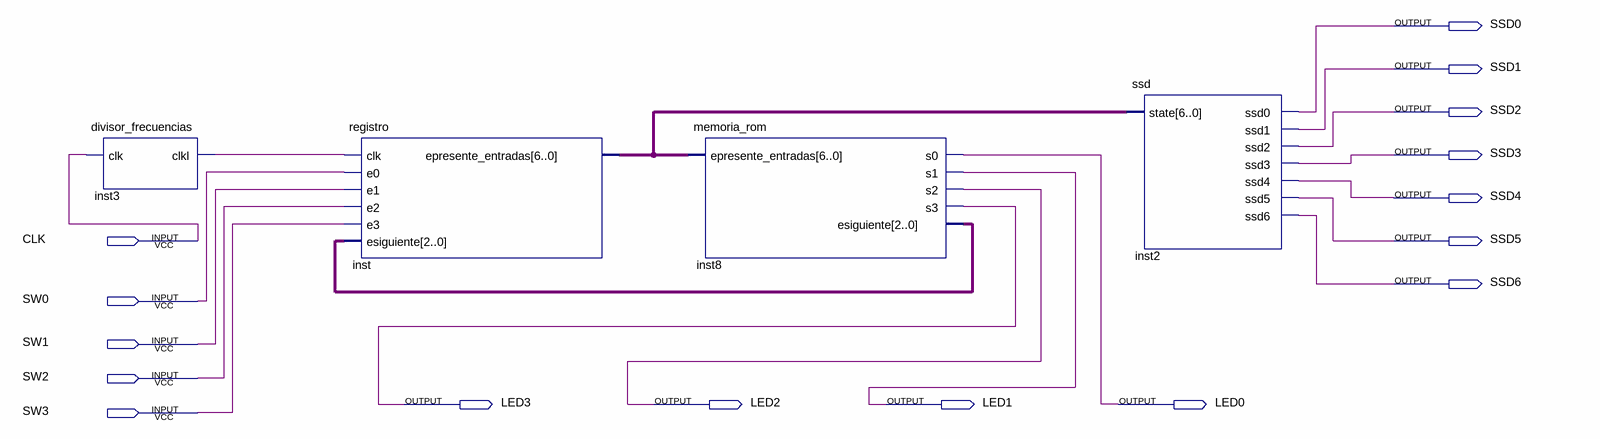
[diagram p0: schematic sheet]
// Quartus schematic Practica2.bdf as structural Verilog: 4 symbols, 16 pins
module Practica2 (
  input  CLK,
  input  SW0,
  input  SW1,
  input  SW2,
  input  SW3,
  output SSD0,
  output SSD1,
  output SSD2,
  output SSD3,
  output SSD4,
  output SSD5,
  output SSD6,
  output LED3,
  output LED2,
  output LED1,
  output LED0
);

  wire inst3_clkl;
  wire [2:0] inst8_esiguiente;
  wire [6:0] inst_epresente_entradas;

  divisor_frecuencias inst3 (.clk(CLK), .clkl(inst3_clkl));
  registro inst (
    .clk(inst3_clkl), .e0(SW0), .e1(SW1), .e2(SW2), .e3(SW3), .esiguiente(inst8_esiguiente),
    .epresente_entradas(inst_epresente_entradas));
  memoria_rom inst8 (
    .epresente_entradas(inst_epresente_entradas), .s0(LED0), .s1(LED1), .s2(LED2), .s3(LED3),
    .esiguiente(inst8_esiguiente));
  ssd inst2 (
    .state(inst_epresente_entradas), .ssd0(SSD0), .ssd1(SSD1), .ssd2(SSD2), .ssd3(SSD3), .ssd4(SSD4),
    .ssd5(SSD5), .ssd6(SSD6));
endmodule
